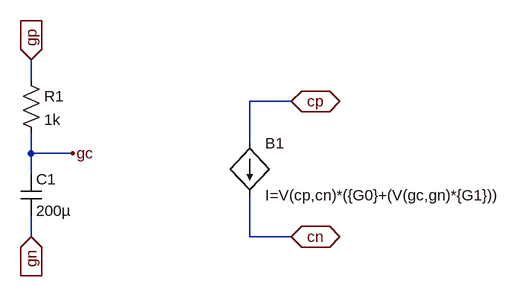
[diagram p0: schematic capteur.asc]
capteur.asc, the LTspice schematic file:
Version 4
SHEET 1 880 680
WIRE -144 32 -144 0
WIRE 256 64 192 64
WIRE 192 128 192 64
WIRE -144 144 -144 112
WIRE -80 144 -144 144
WIRE -144 176 -144 144
WIRE -144 272 -144 240
WIRE 192 272 192 208
WIRE 256 272 192 272
FLAG 256 64 cp
IOPIN 256 64 BiDir
FLAG 256 272 cn
IOPIN 256 272 BiDir
FLAG -144 0 gp
IOPIN -144 0 In
FLAG -144 272 gn
IOPIN -144 272 In
FLAG -80 144 gc
SYMBOL bi 192 128 R0
SYMATTR InstName B1
SYMATTR Value I=V(cp,cn)*({G0}+(V(gc,gn)*{G1}))
SYMBOL res -160 16 R0
SYMATTR InstName R1
SYMATTR Value 1k
SYMBOL cap -160 176 R0
SYMATTR InstName C1
SYMATTR Value 200µ

The netlist it stands for:
* capteur.asc
B1 cp cn I=V(cp,cn)*({G0}+(V(gc,gn)*{G1}))
R1 gp gc 1k
C1 gc gn 200µ
.backanno
.end